# Altium schematic sheet Opto_Sheet.SchDoc
size 420 x 297 mm; SheetNumber: 2; SheetTotal: 3
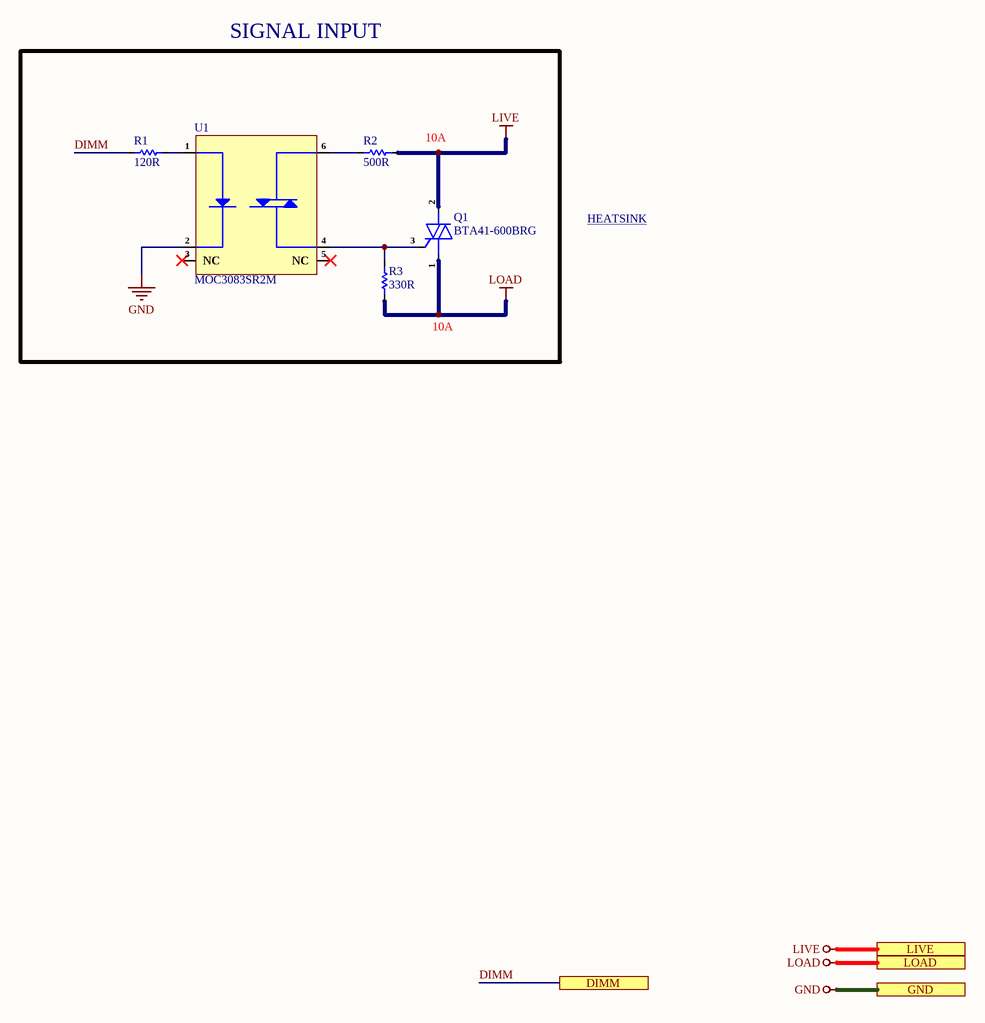
[diagram p0: Opto_Sheet.SchDoc]

## Parts
Q1  BTA41-600BRG  [TO552P1530X450X2110-3B]
R1  120R  [Res-0402]
R2  500R  [EWWR0006J500RT9]
R3  330R  [Res-1206]
U1  MOC3083SR2M  [SMD-6P]

## Ports
DIMM (see Top_Sheet[4B], Connector_Sheet[4D]), GND (see Top_Sheet[4B]), LIVE (see Top_Sheet[4A], Connector_Sheet[5D]), LOAD (see Top_Sheet[4B], Connector_Sheet[5D])

## Nets
GND: U1.2 ; port GND
LIVE: Q1.2(M2) R2.2 ; port LIVE
LOAD: Q1.1(M1) R3.1 ; port LOAD
DIMM: R1.1 ; port DIMM
NetQ1_3: Q1.3(G) R3.2 U1.4
NetR1_2: R1.2 U1.1
NetR2_1: R2.1 U1.6

Not connected (* = marked no-connect by the designer): U1 3(NC)* 5(NC)*

## Notes on the sheet
- SIGNAL INPUT
- (near R2) 10A
- HEATSINK <https://www.lcsc.com/product-detail/Heat-sink-heatsink_XSD-23-5-16-25_C4661.html>
- 10A
- File:
- Title:
- Date:
- Page
- Num:
- Total:
- Drawn By: Huzaifa Ali

## Library data of the parts
Q1 = BTA41-600BRG: 80mA 50mA 600V TOP-3 Thyristors (SCR)/Modules ROHS; Manufacturer: STMicroelectronics; ComponentLink1Description: LCSC Link; ComponentLink1URL: https://www.lcsc.com/product-detail/Thyristors-SCR-Modules_STMicroelectronics-BTA41-600BRG_C9103.html; Manufacturer Part Number: BTA41-600BRG; LCSC Part Number: C9103; Item Type: Thyristors; Package: TOP-3
R1 = RC0402FR-07120RL: RES 120 OHM 1% 1/16W 0402; Manufacturer: Yageo; Item Type: Resistors; Power Rating: 62.5mW; Voltage Rating: 50V; Temperature Coefficient: 100ppm/°C; Max Power Dissipation: 63mW; Supplier: Future Electronics; Supplier Part Number: 4529079; Manufacturer Part Number: RC0402FR-07120RL; RoHS: Yes; Stock: 150000; Pricing: 10000=0.0012, 100000=0.0011, 300000=0.001, 750000=0.001, 2000000=0.0009 (USD); Case/Package: 0402; Case Code (Imperial): 0402; Case Code (Metric): 1005; Min Operating Temperature: -55°C; Max Operating Temperature: 155°C; Package Quantity: 1; Value: 120R; Tolerance: 1%; Packaging: Tape and Reel; Termination: SMD/SMT; Resistor Type: Thick Film; Number of Terminations: 2; Features: Moisture Resistant; Series: RC; Resistance Tolerance: 1%; Construction: Rectangular; Technology: THICK FILM; Voltage Rating (AC): 50V; Length: 0.039inch; Width: 0.02inch; Height: 0.016inch; Depth: 0.5mm; Reach SVHC Compliant: No; Military Standard: Not; RoHS Compliant: Yes; Lead Free: 5697LeadFree; ComponentLink1URL: https://datasheet.ciiva.com/12667/pyu-rc0402-51-rohs-l-6-r-12667958.pdf?src-supplier=Mouser; ComponentLink1Description: https://datasheet.ciiva.com/12667/pyu-rc0402-51-rohs-l-6-r-12667958.pdf?src-supplier=Mouser; ComponentLink2URL: https://datasheet.ciiva.com/7849/1018594-7849831.pdf?src-supplier=Element14; ComponentLink2Description: https://datasheet.ciiva.com/7849/1018594-7849831.pdf?src-supplier=Element14; LCSC Part Number: C114758
R2 = EWWR0006J500RT9: Wirewound Resistors 500Ω 6W ±250ppm/℃ ±5% Plugin,D8xL23.5mm Through Hole Resistors ROHS; Manufacturer: RESI; Manufacturer Part Number: EWWR0006J500RT9; LCSC Part Number: C348990; Item Type: Resistor; Package: Plugin,D8xL23.5mm; ComponentLink1Description: LCSC Link; ComponentLink1URL: https://www.lcsc.com/product-detail/Through-Hole-Resistors_RESI-EWWR0006J500RT9_C348990.html
R3 = HP06W2J0331T5E: 500mW Thick Film Resistors 200V ±100ppm/℃ ±5% 330Ω 1206 Chip Resistor - Surface Mount ROHS; Manufacturer: Royal Electronic Factory; Supplier: Mouser; LCSC Part Number: C414913; Manufacturer Part Number: HP06W2J0331T5E; RoHS: Yes; Pricing: 10000=0.006 (USD); Item Type: Resistor
U1 = MOC3083SR2M: OPTOISOLATOR 4.17KV TRIAC 6SMD; Manufacturer: ON Semiconductor / Fairchild; Number of Channels: 1; Hold Current: 500uA; Nominal Supply Voltage: 1.3V; Max Supply Voltage: 1.5V; Forward Current: 60mA; Output Voltage: 800V; Reverse Breakdown Voltage: 6V; Max Power Dissipation: 250mW; Isolation Voltage: 4.2kV; Isolation Voltage-Max: 7.5kV; Item Type: IC; Supplier: Future Electronics; LCSC Part Number: C111561; Manufacturer Part Number: MOC3083SR2M; RoHS: Yes; Stock: 26000; Pricing: 1000=0.365, 2000=0.355, 3000=0.35, 4000=0.345, 5000=0.335 (USD); Mounting Technology: Surface Mount; Case/Package: SMD/SMT; Pins: 6; Weight: 0.81g; Min Operating Temperature: -40°C; Max Operating Temperature: 85°C; Packaging: Tape and Reel; Forward Voltage: 1.3V; Max Input Current: 60mA; Number of Elements: 1; Power Dissipation: 250mW; Max Output Voltage: 800V; Input Current: 60mA; Number of Circuits: 1; Series: -; Reverse Voltage: 6V; Height: 4.8mm; Radiation Hardening: No; Reach SVHC Compliant: No; Lead Free: Lead Free; RoHS Compliant: Yes; ComponentLink1URL: https://datasheet.ciiva.com/25620/0900766b810df541-25620726.pdf?src-supplier=Rs; ComponentLink1Description: https://datasheet.ciiva.com/25620/0900766b810df541-25620726.pdf?src-supplier=Rs; ComponentLink2URL: https://datasheet.ciiva.com/15118/getdatasheetpartid-67311-15118215.pdf?src-supplier=Verical; ComponentLink2Description: https://datasheet.ciiva.com/15118/getdatasheetpartid-67311-15118215.pdf?src-supplier=Verical; ComponentLink3URL: https://datasheet.ciiva.com/2093/moc3083m-2093280.pdf?src-supplier=Digikey; ComponentLink3Description: https://datasheet.ciiva.com/2093/moc3083m-2093280.pdf?src-supplier=Digikey; ComponentLink4URL: https://datasheet.ciiva.com/16744/moc3083m-16744701.pdf?src-supplier=Future+Electronics; ComponentLink4Description: https://datasheet.ciiva.com/16744/moc3083m-16744701.pdf?src-supplier=Future+Electronics; ComponentLink5URL: https://datasheet.ciiva.com/8099/moc3081m-8099621.pdf?src-supplier=Avnet; ComponentLink5Description: https://datasheet.ciiva.com/8099/moc3081m-8099621.pdf?src-supplier=Avnet; ComponentLink6URL: https://datasheet.ciiva.com/2093/moc3083m-2093279.pdf?src-supplier=Digikey; ComponentLink6Description: https://datasheet.ciiva.com/2093/moc3083m-2093279.pdf?src-supplier=Digikey; ComponentLink7URL: https://datasheet.ciiva.com/2093/moc3083m-2093278.pdf?src-supplier=Digikey; ComponentLink7Description: https://datasheet.ciiva.com/2093/moc3083m-2093278.pdf?src-supplier=Digikey